# EAGLE schematic YOTSUBA_GNSS-receiver_Orion_ver.1.5 (EAGLE 9.6.2)
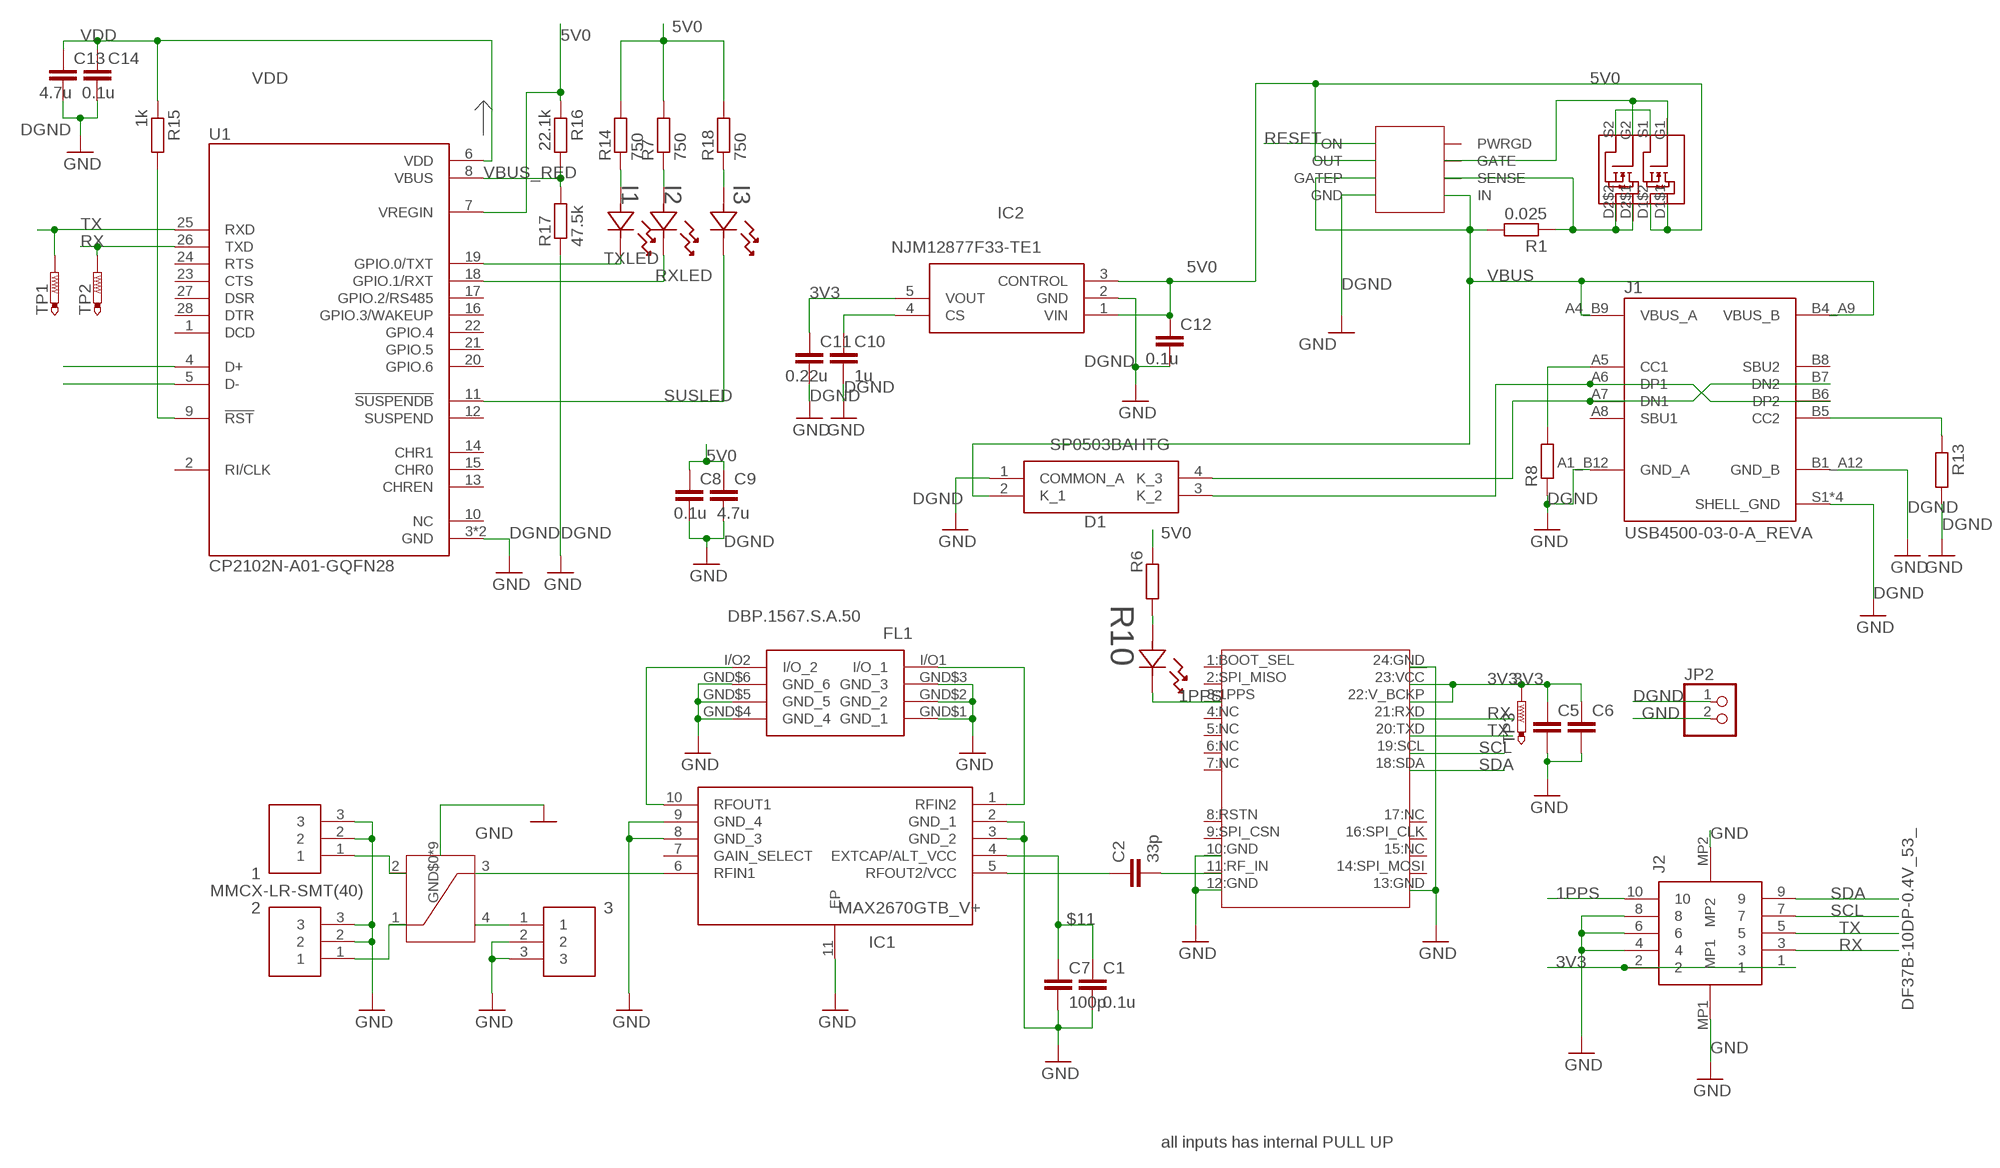
[diagram p0: schematic, sheet 1]

## Parts
1  MMCX-LR-SMT(40)  [MMCX-LR-SMT(40)]
2  MMCX-LR-SMT(40)  [MMCX-LR-SMT(40)]
3  MMCX-LR-SMT(40)  [MMCX-LR-SMT(40)]
C1  0.1u  C-EUC1608  [C1608]
C2  33p  C-EUC1608  [C1608]
C5  C-EUC1608  [C1608]
C6  C-EUC1608  [C1608]
C7  100p  C-EUC1608  [C1608]
C8  0.1u  C-EUC1608  [C1608]
C9  4.7u  C-EUC1608  [C1608]
C10  1u  C-EUC1608  [C1608]
C11  0.22u  C-EUC1608  [C1608]
C12  0.1u  C-EUC1608  [C1608]
C13  4.7u  C-EUC1608  [C1608]
C14  0.1u  C-EUC1608  [C1608]
D1  SP0503BAHTG  [SP0503BAHTG]
FL1  DBP.1567.S.A.50  [DBP1567SA50]
I1  SML-E12P8WT86  [LED_SMLD12_ROM]
I2  SML-E12P8WT86  [LED_SMLD12_ROM]
I3  SML-E12P8WT86  [LED_SMLD12_ROM]
IC1  MAX2670GTB_V+  [SON50P300X300X80-11N]
IC2  NJM12877F33-TE1  [SOT95P280X120-5N]
J1  USB4500-03-0-A_REVA  [GCT_USB4500-03-0-A_REVA]
J2  DF37B-10DP-0.4V_53_  [DF37B10DP04V53]
JP2  PINHD-1X2/90  [1X02/90]
R1  0.025  R-EU_R0603  [R0603]
R6  R-EU_R0603  [R0603]
R7  750  R-EU_R0603  [R0603]
R8  R-EU_R0603  [R0603]
R10  SML-E12P8WT86  [LED_SMLD12_ROM]
R13  R-EU_R0603  [R0603]
R14  750  R-EU_R0603  [R0603]
R15  1k  R-EU_R0603  [R0603]
R16  22.1k  R-EU_R0603  [R0603]
R17  47.5k  R-EU_R0603  [R0603]
R18  750  R-EU_R0603  [R0603]
TP1  PTR1B1,27  [B1,27]
TP2  PTR1B1,27  [B1,27]
TP3  PTR1B1,27  [B1,27]
U1  CP2102N-A01-GQFN28  [QFN50P500X500X80-29N]
U$1  ORION_B16  [ORION_B16]
U$3  HC125.A  [HC125.A]
U$7  DMG6898LSD  [SOIC127P600X150-8N]
U$8  LTC4361  [SOP65P280X100-8N]

## Nets
1PPS: J2.10 R10.1 U$1.3:1PPS
3V3 [POWER]: C5.1 C6.1 C11.1 IC2.5(VOUT) J2.1 J2.2 TP3.TP U$1.22:V_BCKP U$1.23:VCC
5V0 [POWER]: C8.1 C9.1 C12.1 IC2.1(VIN) IC2.3(CONTROL) R6.2 R7.2 R14.2 R16.1 R18.2 U1.7(VREGIN) U$7.D1$1 U$7.D1$2 U$8.OUT
$11 [POWER]: C1.1 C7.1 IC1.4(EXTCAP/ALT_VCC)
D+: D1.3(K_2) J1.A6(DP1) J1.B6(DP2) U1.4(D+)
D-: D1.4(K_3) J1.A7(DN1) J1.B7(DN2) U1.5(D-)
DGND [gnd]: C8.2 C9.2 C10.2 C11.2 C12.2 C13.2 C14.2 D1.1(COMMON_A) IC2.2(GND) J1.A1_B12(GND_A) J1.B1_A12(GND_B) J1.S1(SHELL_GND) J1.S2(SHELL_GND) J1.S3(SHELL_GND) J1.S4(SHELL_GND) JP2.1 R8.1 R13.2 R17.1 U1.3(GND) U1.29(GND) U$8.GND ; supply symbol labelled GND
GND [gnd]: 1.2 1.3 2.2 2.3 3.2 3.3 C1.2 C5.2 C6.2 C7.2 FL1.GND$1(GND_1) FL1.GND$2(GND_2) FL1.GND$3(GND_3) FL1.GND$4(GND_4) FL1.GND$5(GND_5) FL1.GND$6(GND_6) IC1.2(GND_1) IC1.3(GND_2) IC1.8(GND_3) IC1.9(GND_4) IC1.11(EP) J2.4 J2.6 J2.8 J2.MP1 J2.MP2 JP2.2 U$1.10:GND U$1.12:GND U$1.13:GND U$1.24:GND U$3.GND$0(GND) U$3.GND$1(GND) U$3.GND$2(GND) U$3.GND$3(GND) U$3.GND$4(GND) U$3.GND$5(GND) U$3.GND$6(GND) U$3.GND$7(GND) U$3.GND$8(GND)
N$1 [1.1mm]: 1.1 U$3.2
N$2 [1.1mm]: 2.1 U$3.1
N$3 [50Ω]: IC1.6(RFIN1) U$3.3
N$4: C10.1 IC2.4(CS)
N$5: I2.2 R7.1
N$6 [1.1mm]: 3.1 U$3.4
N$8 [50Ω]: FL1.I/O2(I/O_2) IC1.10(RFOUT1)
N$9 [50Ω]: FL1.I/O1(I/O_1) IC1.1(RFIN2)
N$11 [50Ω]: C2.1 IC1.5(RFOUT2/VCC)
N$12 [50Ω]: C2.2 U$1.11:RF_IN
N$13: I1.2 R14.1
N$15: R6.1 R10.2
N$16: I3.2 R18.1
N$19: U$7.S1 U$7.S2
N$20: R1.1 U$7.D2$1 U$7.D2$2 U$8.SENSE
N$21: J1.B5(CC2) R13.1
N$22: U$7.G1 U$7.G2 U$8.GATE
N$23: J1.A5(CC1) R8.2
N$27: R15.2 U1.9(!RST)
RESET [gnd]: U$8.ON
RX: J2.3 TP2.TP U1.26(TXD) U$1.21:RXD
RXLED: I2.1 U1.18(GPIO.1/RXT)
SCL: J2.7 U$1.19:SCL
SDA: J2.9 U$1.18:SDA
SUSLED: I3.1 U1.11(!SUSPENDB)
TX: J2.5 TP1.TP U1.25(RXD) U$1.20:TXD
TXLED: I1.1 U1.19(GPIO.0/TXT)
VBUS: D1.2(K_1) J1.A4_B9(VBUS_A) J1.B4_A9(VBUS_B) R1.2 U$8.GATEP U$8.IN
VBUS_RED: R16.2 R17.2 U1.8(VBUS)
VDD: C13.1 C14.1 R15.1 U1.6(VDD)
Unconnected: IC1.7(GAIN_SELECT) J1.A8(SBU1) J1.B8(SBU2) U1.1(DCD) U1.2(RI/CLK) U1.10(NC) U1.12(SUSPEND) U1.13(CHREN) U1.14(CHR1) U1.15(CHR0) U1.16(GPIO.3/WAKEUP) U1.17(GPIO.2/RS485) U1.20(GPIO.6) U1.21(GPIO.5) U1.22(GPIO.4) U1.23(CTS) U1.24(RTS) U1.27(DSR) U1.28(DTR) U$1.1:BOOT_SEL U$1.2:SPI_MISO U$1.4:NC U$1.5:NC U$1.6:NC U$1.7:NC U$1.8:RSTN U$1.9:SPI_CSN U$1.14:SPI_MOSI U$1.15:NC U$1.16:SPI_CLK U$1.17:NC U$8.PWRGD

## Notes on the sheet
- all inputs has internal PULL UP

## Library data of the parts
1-3 = MMCX-LR-SMT(40):MMCX-LR-SMT(40)
C1 C2 C5-C14 = rcl:C-EU: CAPACITOR, European symbol; SPICEPREFIX: C
D1 = SamacSys_Parts:SP0503BAHTG: ESD Suppressors / TVS Diodes TVS AVAL DIODE SMT Source: Datasheet <https://nl.mouser.com/datasheet/2/240/Littelfuse_TVS_Diode_Array_SP05_Datasheet.pdf-777043.pdf>; ARROW_PART_NUMBER: SP0503BAHTG; ARROW_PRICE-STOCK: https://www.arrow.com/en/products/sp0503bahtg/littelfuse?region=europe; DESCRIPTION: ESD Suppressors / TVS Diodes TVS AVAL DIODE SMT; HEIGHT: 1.22mm; MANUFACTURER_NAME: LITTELFUSE; MANUFACTURER_PART_NUMBER: SP0503BAHTG; MOUSER_PART_NUMBER: 576-SP0503BAHTG; MOUSER_PRICE-STOCK: https://www.mouser.co.uk/ProductDetail/Littelfuse/SP0503BAHTG?qs=uD%2FdkN7XIa0NTYXwHdELYA%3D%3D
FL1 = DBP.1567.S.A.50:DBP.1567.S.A.50: Ceramic Filters Band Pass 1567.5MHz 1dB 50Ohm SMD 2Pin Source: Datasheet <https://www.taoglas.com/datasheets/DBP.1567.S.A.50.pdf>; DESCRIPTION: Ceramic Filters Band Pass 1567.5MHz 1dB 50Ohm SMD 2Pin; HEIGHT: 4.2mm; MANUFACTURER_NAME: Taoglas; MANUFACTURER_PART_NUMBER: DBP.1567.S.A.50
I1-I3 R10 = LED_1608_2:SML-E12P8WT86; COPYRIGHT: Copyright (C) 2023 Ultra Librarian. All rights reserved.; DIGI-KEY_PART_NUMBER_1: 511-1585-1-ND; DIGI-KEY_PART_NUMBER_2: 511-1585-2-ND; DIGI-KEY_PART_NUMBER_3: 511-1585-6-ND; MANUFACTURER_PART_NUMBER: SML-E12P8WT86; MFR_NAME: ROHM Semiconductor
IC1 = MAX2670GTB_V+:MAX2670GTB_V+: RF Amplifier GPS/GNSS Front End Amplifier Source: Datasheet <https://componentsearchengine.com/Datasheets/1/MAX2670GTB_V .pdf>; DESCRIPTION: RF Amplifier GPS/GNSS Front End Amplifier; HEIGHT: 0.8mm; MANUFACTURER_NAME: Analog Devices; MANUFACTURER_PART_NUMBER: MAX2670GTB/V+; MOUSER_PART_NUMBER: 700-MAX2670GTB/V+; MOUSER_PRICE-STOCK: https://www.mouser.com/Search/Refine.aspx?Keyword=700-MAX2670GTB%2FV%2B
IC2 = SamacSys_Parts:NJM12877F33-TE1: LDO Voltage Regulators LDO ADJ High Ripple 3.3V Vo 1% 200mA Source: Datasheet <https://datasheet.datasheetarchive.com/originals/distributors/Datasheets_SAMA/e828f6bebe4b9138c37698b69374413c.pdf>; DESCRIPTION: LDO Voltage Regulators LDO ADJ High Ripple 3.3V Vo 1% 200mA; HEIGHT: 1.2mm; MANUFACTURER_NAME: New Japan Radio; MANUFACTURER_PART_NUMBER: NJM12877F33-TE1; MOUSER_PART_NUMBER: 513-NJM12877F33-TE1; MOUSER_PRICE-STOCK: https://www.mouser.com/Search/Refine.aspx?Keyword=513-NJM12877F33-TE1
J1 = USB4500-03-0-A_REVA:USB4500-03-0-A_REVA; DESCRIPTION: USB-C (USB TYPE-C) USB 2.0 Receptacle Connector 24 (16+8 Dummy) Position Board Edge, Cutout; Surface Mount; Through Hole, Right Angle; DIGI-KEY_PART_NUMBER: 2073-USB4500-03-0-ATR-ND; MF: Global Connector Technology; MP: USB4500-03-0-A; PACKAGE: None; PURCHASE-URL: https://pricing.snapeda.com/search/part/USB4500-03-0-A/?ref=eda
J2 = DF37B-10DP-0.4V_53_:DF37B-10DP-0.4V_53_: Board to Board & Mezzanine Connectors 0.4MM 10P HEADER VERT SMT M-FITTING Source: Datasheet <https://www.arrow.com/en/products/df37b-10dp-0.4v-53/hirose-electric>; DESCRIPTION: Board to Board & Mezzanine Connectors 0.4MM 10P HEADER VERT SMT M-FITTING; HEIGHT: 0.76mm; MANUFACTURER_NAME: Hirose; MANUFACTURER_PART_NUMBER: DF37B-10DP-0.4V(53); MOUSER_PART_NUMBER: 798-DF37B10DP04V53; MOUSER_PRICE-STOCK: https://www.mouser.co.uk/ProductDetail/Hirose-Connector/DF37B-10DP-0.4V53?qs=eDUdFcBPps0qYYvduP3T2g%3D%3D
JP2 = pinhead:PINHD-1X2: PIN HEADER
R1 R6-R8 R13-R18 = rcl:R-EU_: RESISTOR, European symbol; SPICEPREFIX: R
TP1-TP3 = testpad:PTR1: TEST PIN
U1 = CP2102N-A01-GQFN28:CP2102N-A01-GQFN28: USB Bridge, USB to UART USB 2.0 UART Interface 28-QFN (5x5) Check availability <https://pricing.snapeda.com/parts/CP2102N-A01-GQFN28/Silicon%20Labs/view-part?ref=eda>; AVAILABILITY: In Stock; DESCRIPTION: USB Bridge, USB to UART USB 2.0 UART Interface 28-QFN (5x5); MF: Silicon Labs; MP: CP2102N-A01-GQFN28; PACKAGE: QFN-28 Silicon Labs; PRICE: None; PURCHASE-URL: https://pricing.snapeda.com/search/part/CP2102N-A01-GQFN28/?ref=eda
U$1 = Orion_B16:ORION_B16
U$3 = HC125.A:HC125.A
U$7 = DMG6898LSD:DMG6898LSD
U$8 = ltc4361:LTC4361

## Net classes
0 default: clearance 0.121 mm
2 gnd: clearance 0.21 mm to class 1, clearance 0.254 mm
3 POWER: width 0.178 mm, clearance 0.025 mm
4 1.1mm: clearance 0.247 mm to class 1